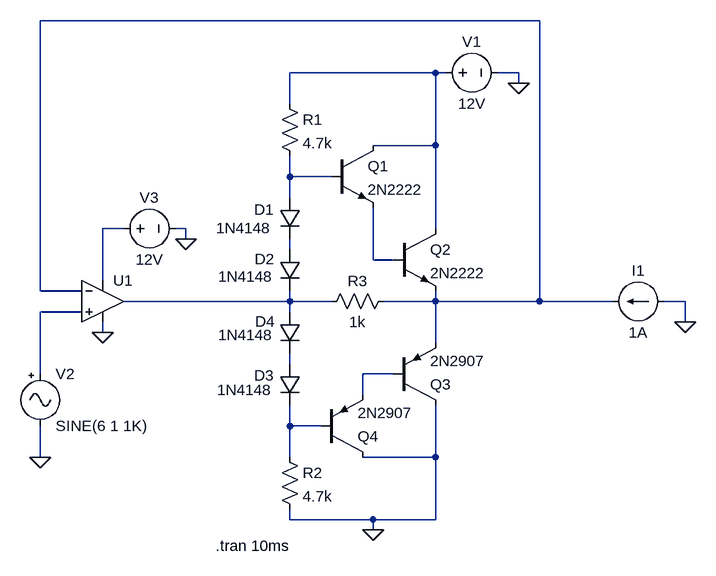
[diagram p0: schematic Draft1.asc]
Draft1.asc, the LTspice schematic file:
Version 4
SHEET 1 880 680
WIRE 496 -144 -272 -144
WIRE 336 -64 112 -64
WIRE 352 -64 336 -64
WIRE 464 -64 432 -64
WIRE 464 -48 464 -64
WIRE 112 -16 112 -64
WIRE 336 48 336 -64
WIRE 336 48 240 48
WIRE 112 96 112 64
WIRE 176 96 112 96
WIRE 112 128 112 96
WIRE -144 176 -176 176
WIRE -48 176 -64 176
WIRE 336 176 336 48
WIRE -48 192 -48 176
WIRE 112 208 112 192
WIRE 240 224 240 144
WIRE 272 224 240 224
WIRE -176 256 -176 176
WIRE -272 272 -272 -144
WIRE -208 272 -272 272
WIRE 112 288 112 272
WIRE 112 288 -144 288
WIRE 176 288 112 288
WIRE 336 288 336 272
WIRE 336 288 256 288
WIRE 496 288 496 -144
WIRE 496 288 336 288
WIRE 608 288 496 288
WIRE 720 288 688 288
WIRE -208 304 -272 304
WIRE 112 304 112 288
WIRE 720 320 720 288
WIRE -176 336 -176 320
WIRE 336 352 336 288
WIRE 112 384 112 368
WIRE -272 400 -272 304
WIRE 272 400 224 400
WIRE 224 432 224 400
WIRE 112 480 112 448
WIRE 160 480 112 480
WIRE -272 528 -272 480
WIRE 112 528 112 480
WIRE 336 528 336 448
WIRE 336 528 224 528
WIRE 112 624 112 608
WIRE 240 624 112 624
WIRE 336 624 336 528
WIRE 336 624 240 624
WIRE 240 640 240 624
FLAG 464 -48 0
FLAG 240 640 0
FLAG -272 528 0
FLAG 720 320 0
FLAG -48 192 0
FLAG -176 336 0
SYMBOL npn 176 48 R0
SYMATTR InstName Q1
SYMATTR Value 2N2222
SYMBOL npn 272 176 R0
SYMATTR InstName Q2
SYMATTR Value 2N2222
SYMBOL pnp 272 448 M180
SYMATTR InstName Q3
SYMATTR Value 2N2907
SYMBOL pnp 160 528 M180
SYMATTR InstName Q4
SYMATTR Value 2N2907
SYMBOL res 96 -32 R0
SYMATTR InstName R1
SYMATTR Value 4.7k
SYMBOL res 96 512 R0
SYMATTR InstName R2
SYMATTR Value 4.7k
SYMBOL diode 96 128 R0
WINDOW 0 -39 19 Left 2
WINDOW 3 -97 47 Left 2
SYMATTR InstName D1
SYMATTR Value 1N4148
SYMBOL diode 96 208 R0
WINDOW 0 -38 15 Left 2
WINDOW 3 -94 42 Left 2
SYMATTR InstName D2
SYMATTR Value 1N4148
SYMBOL diode 96 384 R0
WINDOW 0 -39 18 Left 2
WINDOW 3 -96 40 Left 2
SYMATTR InstName D3
SYMATTR Value 1N4148
SYMBOL diode 96 304 R0
WINDOW 0 -37 15 Left 2
WINDOW 3 -94 36 Left 2
SYMATTR InstName D4
SYMATTR Value 1N4148
SYMBOL res 272 272 R90
WINDOW 0 0 56 VBottom 2
WINDOW 3 32 56 VTop 2
SYMATTR InstName R3
SYMATTR Value 1k
SYMBOL voltage 336 -64 R270
WINDOW 0 32 56 VTop 2
WINDOW 3 -32 56 VBottom 2
WINDOW 123 0 0 Left 0
WINDOW 39 0 0 Left 0
SYMATTR InstName V1
SYMATTR Value 12V
SYMBOL Misc\\signal -272 384 R0
WINDOW 123 0 0 Left 0
WINDOW 39 0 0 Left 0
SYMATTR InstName V2
SYMATTR Value SINE(6 1 1K)
SYMBOL current 688 288 R90
WINDOW 0 -32 40 VBottom 2
WINDOW 3 32 40 VTop 2
SYMATTR InstName I1
SYMATTR Value 1A
SYMBOL Opamps\\UniversalOpAmp -176 288 R0
SYMATTR InstName U1
SYMBOL voltage -160 176 R270
WINDOW 0 32 56 VTop 2
WINDOW 3 -32 56 VBottom 2
WINDOW 123 0 0 Left 0
WINDOW 39 0 0 Left 0
SYMATTR InstName V3
SYMATTR Value 12V
TEXT -2 664 Left 2 !.tran 10ms

The netlist it stands for:
* Draft1.asc
Q1 N002 N003 N006 0 2N2222
Q2 N002 N006 N001 0 2N2222
Q3 0 N010 N001 0 2N2907
Q4 0 N011 N010 0 2N2907
R1 N002 N003 4.7k
R2 N011 0 4.7k
D1 N003 N005 1N4148
D2 N005 N007 1N4148
D3 N009 N011 1N4148
D4 N007 N009 1N4148
R3 N001 N007 1k
V1 N002 0 12V
V2 N008 0 SINE(6 1 1K)
I1 0 N001 1A
XU1 N008 N001 N004 0 N007 level1 Avol=1Meg GBW=10Meg Vos=0 En=0 Enk=0 In=0 Ink=0 Rin=500Meg  ; pins In+ In- V+ V- OUT
V3 N004 0 12V
.model D D
.lib standard.dio
.model NPN NPN
.model PNP PNP
.lib standard.bjt
.tran 10ms
.lib UniversalOpAmp1.lib
.backanno
.end